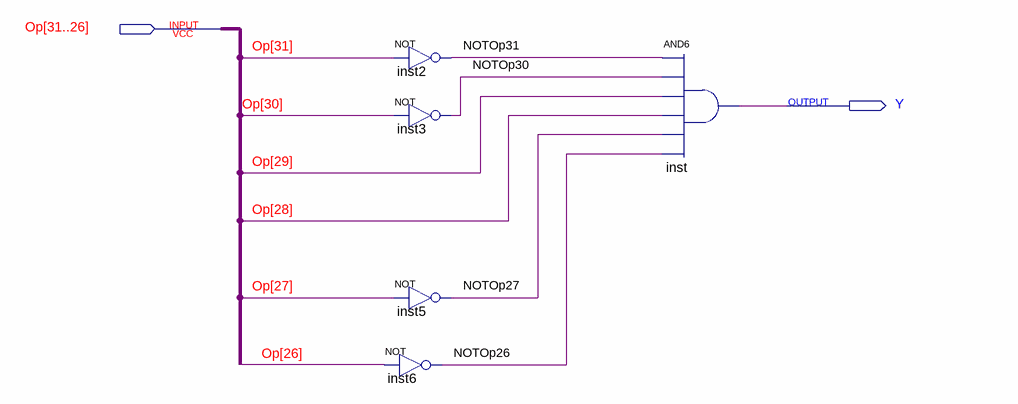
[diagram p0: schematic sheet]
// Quartus schematic ANDI.bdf as structural Verilog: 5 symbols, 2 pins
module ANDI (
  input  [31:26] Op,
  output Y
);

  wire NOTOp26, NOTOp27, NOTOp30, NOTOp31;

  not inst2 (NOTOp31, Op[31]);
  not inst3 (NOTOp30, Op[30]);
  not inst5 (NOTOp27, Op[27]);
  not inst6 (NOTOp26, Op[26]);
  and inst (Y, NOTOp31, NOTOp30, Op[29], Op[28], NOTOp27, NOTOp26);
endmodule
